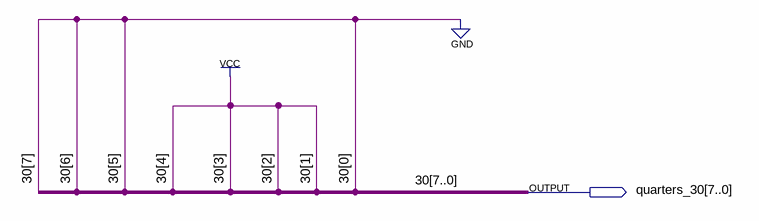
[diagram p0: schematic sheet]
// Quartus schematic quarters_30.bdf as structural Verilog: 0 symbols, 1 pins
module quarters_30 (
  output [7:0] quarters_30
);


  assign quarters_30 = 8'b00011110;
endmodule
